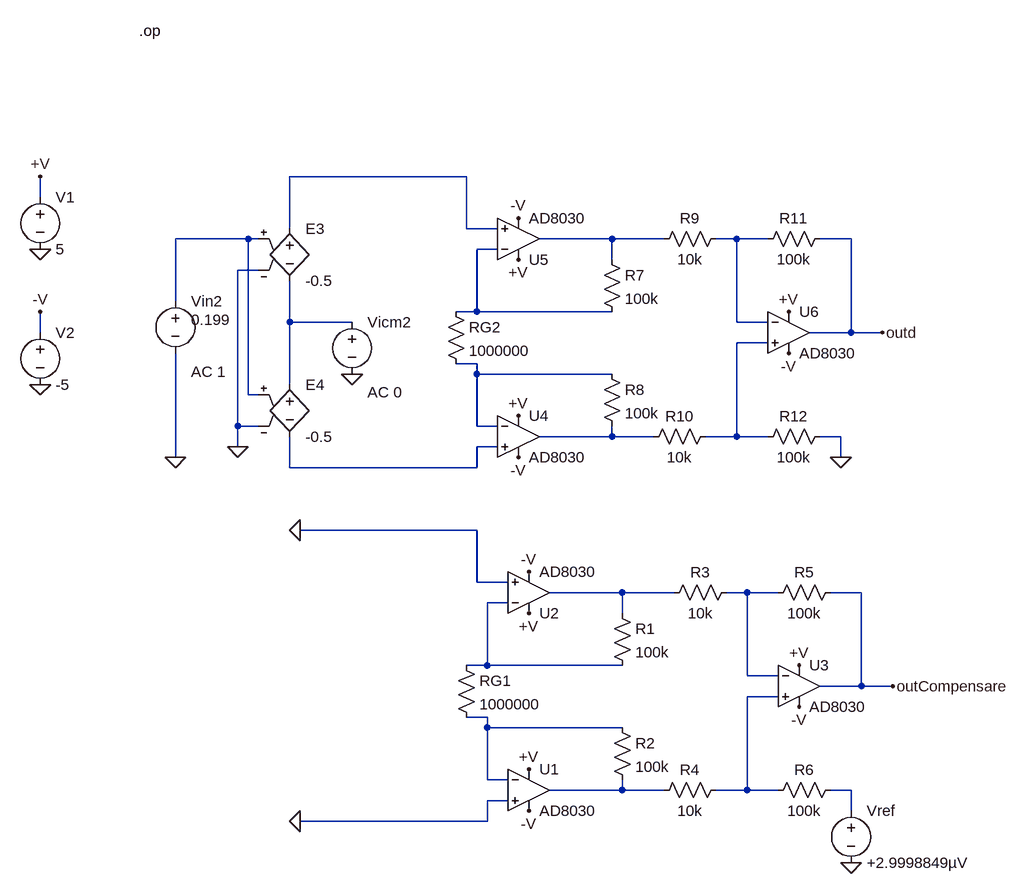
[diagram p0: schematic Stage1_AI.asc]
Stage1_AI.asc, the LTspice schematic file:
Version 4
SHEET 1 880 1060
WIRE -16 -16 -288 -16
WIRE -672 16 -672 -16
WIRE -288 64 -288 -16
WIRE -16 64 -16 -16
WIRE 32 64 -16 64
WIRE -352 80 -464 80
WIRE -336 80 -352 80
WIRE 208 80 96 80
WIRE 288 80 208 80
WIRE 400 80 368 80
WIRE 448 80 400 80
WIRE 576 80 528 80
WIRE 32 96 0 96
WIRE 208 112 208 80
WIRE -336 128 -368 128
WIRE -464 176 -464 80
WIRE 0 192 0 96
WIRE 0 192 -32 192
WIRE 208 192 0 192
WIRE -288 208 -288 144
WIRE -192 208 -288 208
WIRE 400 208 400 80
WIRE 448 208 400 208
WIRE -672 224 -672 192
WIRE 576 224 576 80
WIRE 576 224 512 224
WIRE 624 224 576 224
WIRE 448 240 400 240
WIRE 0 272 -32 272
WIRE 0 288 0 272
WIRE 208 288 0 288
WIRE -288 304 -288 208
WIRE -352 320 -352 80
WIRE -336 320 -352 320
WIRE -368 368 -368 128
WIRE -336 368 -368 368
WIRE 0 368 0 288
WIRE 32 368 0 368
WIRE 208 384 208 368
WIRE 208 384 96 384
WIRE 272 384 208 384
WIRE 400 384 400 240
WIRE 400 384 352 384
WIRE 448 384 400 384
WIRE 560 384 528 384
WIRE -368 400 -368 368
WIRE 32 400 0 400
WIRE -464 416 -464 256
WIRE 560 416 560 384
WIRE -288 432 -288 384
WIRE 0 432 0 400
WIRE 0 432 -288 432
WIRE 0 528 -272 528
WIRE 0 608 0 528
WIRE 48 608 0 608
WIRE 224 624 112 624
WIRE 304 624 224 624
WIRE 416 624 384 624
WIRE 464 624 416 624
WIRE 592 624 544 624
WIRE 48 640 16 640
WIRE 224 656 224 624
WIRE 16 736 16 640
WIRE 16 736 -16 736
WIRE 224 736 16 736
WIRE 416 752 416 624
WIRE 464 752 416 752
WIRE 592 768 592 624
WIRE 592 768 528 768
WIRE 640 768 592 768
WIRE 464 784 416 784
WIRE 16 816 -16 816
WIRE 16 832 16 816
WIRE 224 832 16 832
WIRE 16 912 16 832
WIRE 48 912 16 912
WIRE 224 928 224 912
WIRE 224 928 112 928
WIRE 288 928 224 928
WIRE 416 928 416 784
WIRE 416 928 368 928
WIRE 464 928 416 928
WIRE 576 928 544 928
WIRE 48 944 16 944
WIRE 576 960 576 928
WIRE 16 976 16 944
WIRE 16 976 -272 976
FLAG 64 416 -V
FLAG 624 224 outd
FLAG 560 416 0
FLAG 480 192 +V
FLAG -368 400 0
FLAG -464 416 0
FLAG 480 256 -V
FLAG -192 288 0
FLAG 64 112 +V
FLAG 64 352 +V
FLAG 64 48 -V
FLAG -672 96 0
FLAG -672 304 0
FLAG -672 -16 +V
FLAG -672 192 -V
FLAG 80 960 -V
FLAG 640 768 outCompensare
FLAG 496 736 +V
FLAG 496 800 -V
FLAG 80 656 +V
FLAG 80 896 +V
FLAG 80 592 -V
FLAG -272 528 0
FLAG -272 976 0
FLAG 576 1040 0
DATAFLAG 608 224 ""
DATAFLAG -416 80 ""
DATAFLAG 240 80 ""
DATAFLAG -16 32 ""
DATAFLAG 240 384 ""
DATAFLAG 624 768 ""
DATAFLAG 256 624 ""
DATAFLAG 0 576 ""
DATAFLAG 256 928 ""
SYMBOL res -48 176 R0
SYMATTR InstName RG2
SYMATTR Value 1000000
SYMBOL res 192 96 R0
SYMATTR InstName R7
SYMATTR Value 100k
SYMBOL res 192 272 R0
SYMATTR InstName R8
SYMATTR Value 100k
SYMBOL res 384 64 R90
WINDOW 0 0 56 VBottom 2
WINDOW 3 32 56 VTop 2
SYMATTR InstName R9
SYMATTR Value 10k
SYMBOL res 368 368 R90
WINDOW 0 0 56 VBottom 2
WINDOW 3 32 56 VTop 2
SYMATTR InstName R10
SYMATTR Value 10k
SYMBOL res 544 64 R90
WINDOW 0 0 56 VBottom 2
WINDOW 3 32 56 VTop 2
SYMATTR InstName R11
SYMATTR Value 100k
SYMBOL res 544 368 R90
WINDOW 0 0 56 VBottom 2
WINDOW 3 32 56 VTop 2
SYMATTR InstName R12
SYMATTR Value 100k
SYMBOL voltage -464 160 R0
WINDOW 123 24 124 Left 2
WINDOW 39 0 0 Left 0
WINDOW 3 24 44 Left 2
SYMATTR Value2 AC 1
SYMATTR Value 0.199
SYMATTR InstName Vin2
SYMBOL e -288 48 R0
SYMATTR InstName E3
SYMATTR Value -0.5
SYMBOL e -288 288 R0
SYMATTR InstName E4
SYMATTR Value -0.5
SYMBOL voltage -192 192 R0
WINDOW 123 24 124 Left 2
WINDOW 39 0 0 Left 0
SYMATTR Value2 AC 0
SYMATTR InstName Vicm2
SYMATTR Value ""
SYMBOL OpAmps\\AD8030 64 320 R0
SYMATTR InstName U4
SYMBOL OpAmps\\AD8030 64 144 M180
SYMATTR InstName U5
SYMBOL OpAmps\\AD8030 480 160 R0
SYMATTR InstName U6
SYMBOL voltage -672 0 R0
WINDOW 123 0 0 Left 0
WINDOW 39 0 0 Left 0
SYMATTR InstName V1
SYMATTR Value 5
SYMBOL voltage -672 208 R0
WINDOW 123 0 0 Left 0
WINDOW 39 0 0 Left 0
SYMATTR InstName V2
SYMATTR Value -5
SYMBOL res -32 720 R0
SYMATTR InstName RG1
SYMATTR Value 1000000
SYMBOL res 208 640 R0
SYMATTR InstName R1
SYMATTR Value 100k
SYMBOL res 208 816 R0
SYMATTR InstName R2
SYMATTR Value 100k
SYMBOL res 400 608 R90
WINDOW 0 0 56 VBottom 2
WINDOW 3 32 56 VTop 2
SYMATTR InstName R3
SYMATTR Value 10k
SYMBOL res 384 912 R90
WINDOW 0 0 56 VBottom 2
WINDOW 3 32 56 VTop 2
SYMATTR InstName R4
SYMATTR Value 10k
SYMBOL res 560 608 R90
WINDOW 0 0 56 VBottom 2
WINDOW 3 32 56 VTop 2
SYMATTR InstName R5
SYMATTR Value 100k
SYMBOL res 560 912 R90
WINDOW 0 0 56 VBottom 2
WINDOW 3 32 56 VTop 2
SYMATTR InstName R6
SYMATTR Value 100k
SYMBOL OpAmps\\AD8030 80 864 R0
SYMATTR InstName U1
SYMBOL OpAmps\\AD8030 80 688 M180
SYMATTR InstName U2
SYMBOL OpAmps\\AD8030 496 704 R0
SYMATTR InstName U3
SYMBOL voltage 576 944 R0
SYMATTR InstName Vref
SYMATTR Value +2.9998849µV
TEXT -520 -240 Left 2 !.op

The netlist it stands for:
* Stage1_AI.asc
RG2 N005 N008 1000000
R7 N003 N005 100k
R8 N008 N009 100k
R9 N004 N003 10k
R10 N007 N009 10k
R11 outd N004 100k
R12 0 N007 100k
Vin2 N002 0 0.199 AC 1
E3 N001 N006 N002 0 -0.5
E4 N006 N010 N002 0 -0.5
Vicm2 N006 0 AC 0
XU4 N010 N008 +V -V N009 AD8040  ; AD8030, pins In+ In- V+ V- OUT
XU5 N001 N005 +V -V N003 AD8040  ; AD8030, pins In+ In- V+ V- OUT
XU6 N007 N004 +V -V outd AD8040  ; AD8030, pins In+ In- V+ V- OUT
V1 +V 0 5
V2 -V 0 -5
RG1 N013 N015 1000000
R1 N011 N013 100k
R2 N015 N016 100k
R3 N012 N011 10k
R4 N014 N016 10k
R5 outCompensare N012 100k
R6 N017 N014 100k
XU1 0 N015 +V -V N016 AD8040  ; AD8030, pins In+ In- V+ V- OUT
XU2 0 N013 +V -V N011 AD8040  ; AD8030, pins In+ In- V+ V- OUT
XU3 N014 N012 +V -V outCompensare AD8040  ; AD8030, pins In+ In- V+ V- OUT
Vref N017 0 +2.9998849µV
.op
.lib ADI.lib
.backanno
.end